# EAGLE design btnsm_water (EAGLE 8.3.0)
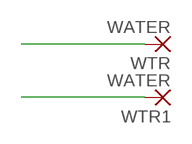
[diagram p0: schematic, sheet 1]

## Parts
WTR  WATER  1,6/0,9  [1,6/0,9]
WTR1  WATER  1,6/0,9  [1,6/0,9]

## Nets
W1: WTR.1(P)
W2: WTR1.1(P)

## Library data of the parts
WTR WTR1 = wirepad:1,6/0,9: THROUGH-HOLE PAD

## Net classes
0 default: width 0.3 mm, drill 0.3 mm, clearance 0.178 mm

## Board
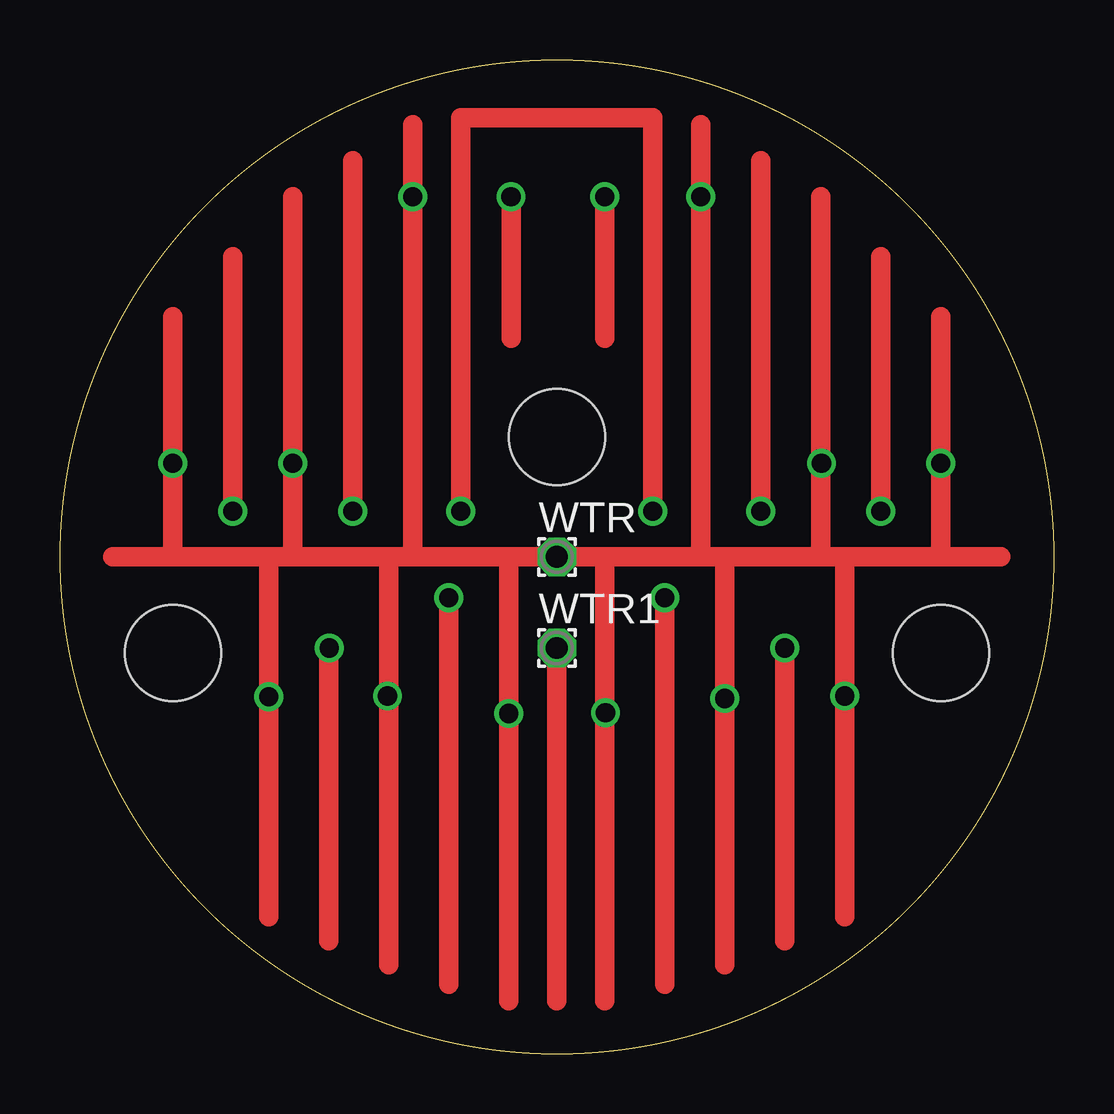
[diagram p1: board, top side]
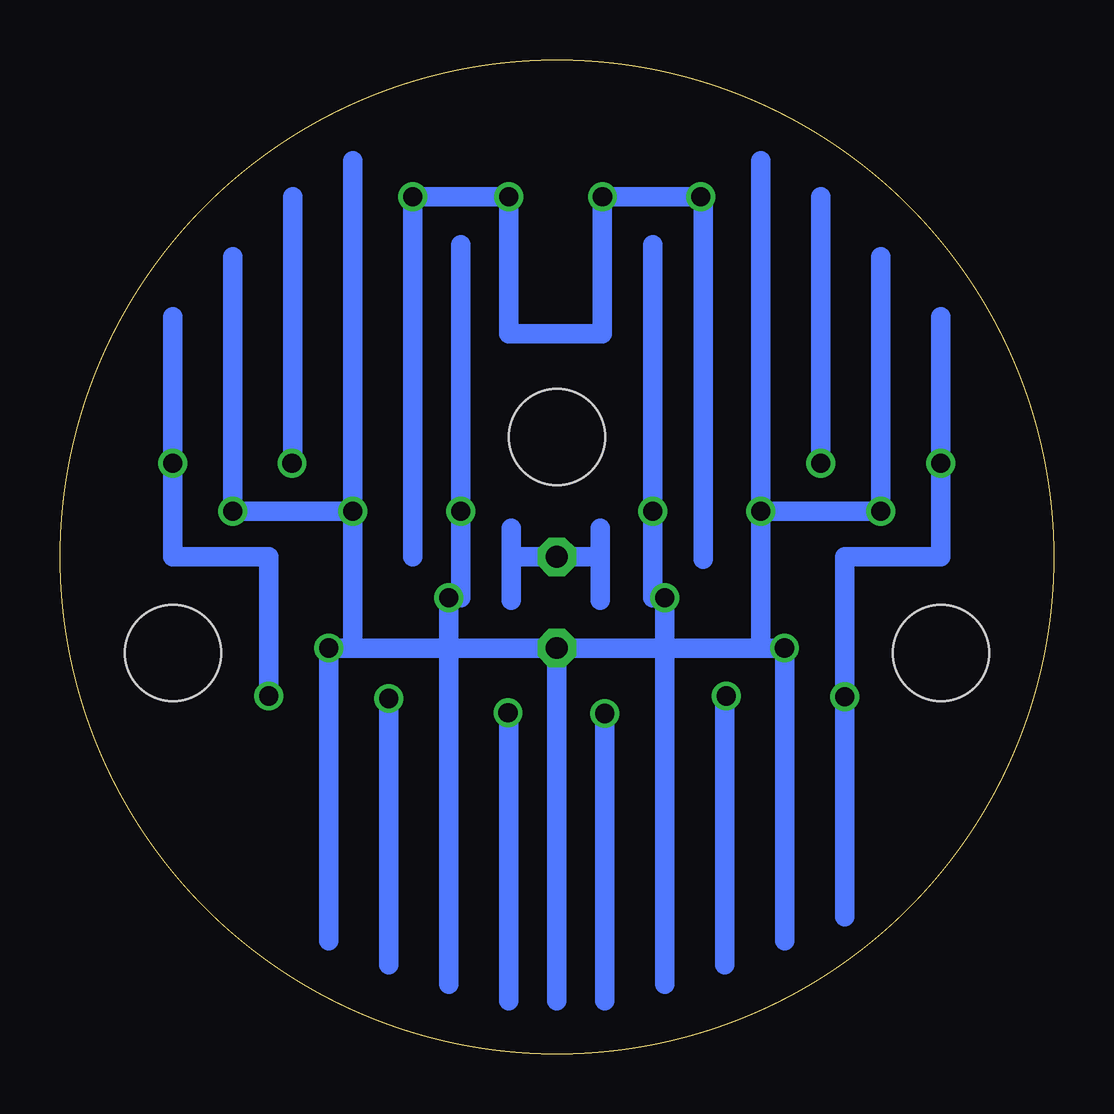
[diagram p2: board, bottom side, seen from below]

Size 41.4 x 41.4 mm. Coordinates in mm from the lower left corner, seen from the top.
Outline: circle at 20.7,20.7 radius 20.7
Copper layers (1*16): Top 0.035mm / dielectric 1.5mm / Bottom 0.035mm
Design rules "SeeedStudio_2layer_DRU_no_angle_20140221": minimum track width 6mil, minimum drill 12mil, track to track 6mil, track to pad 6mil, pad to pad 6mil, via to via 6mil, smd to smd 0mil, copper to edge 10mil, drill to drill 10mil, minimum pad ring 10mil, minimum via ring 6mil, stop-mask expansion 2mil, vias tented up to drill 100mil, thermal gap 10mil
Holes 4 mm at 20.7,25.7 4.7,16.7 36.7,16.7

### Footprints (pad centres in the part's own frame; a part is rotated, then mirrored left to right if it is on the bottom)
1,6/0,9 = drill 0.914 pad 1.6 octagon: 1 0,0

### Placement (x,y rotation side)
WTR  20.7,20.7 0 top
WTR1  20.7,16.9 0 top

### Tracks (layer width: path | path; a pad name or v marks a point on that pad's centre or on a via)
W1  (via drill 0.8)
  Top 0.813: 36.7,20.7 39.2,20.7 | 36.7,20.7 v36.7,24.6 36.7,30.7 | 31.7,24.6 31.7,20.7 | 31.7,24.6 31.7,35.7 | 26.7,20.7 v26.7,35.7 26.7,38.7 | 9.7,20.7 v9.7,24.6 9.7,35.7 | 4.7,20.7 v4.7,24.6 4.7,30.7 | 8.7,20.7 v8.7,14.87 8.7,5.7 | 13.7,14.8 13.7,20.7 | 13.7,14.8 13.7,3.7 | 18.7,2.2 v18.7,14.17 18.7,20.7 | 22.7,14.1 22.7,20.7 | 22.7,14.1 22.7,2.2 | 27.7,20.7 v27.7,14.8 27.7,3.7 | 32.7,20.7 v32.7,14.9 32.7,5.7 | 14.7,20.7 v14.7,35.7 14.7,38.7 | v18.79,35.7 v18.8,35.7 18.8,29.8 | v22.7,35.7 22.7,29.8 | 13.7,14.8 13.64,14.8 v13.64,14.9 | 22.7,14.1 22.73,14.1 v22.73,14.2 | 31.7,24.6 v31.73,24.6 | 4.7,20.7 2.2,20.7 | 4.7,20.7 8.7,20.7 | 8.7,20.7 9.7,20.7 | 13.7,20.7 9.7,20.7 | 18.7,20.7 14.7,20.7 | 18.7,20.7 WTR.1 22.7,20.7 | 13.7,20.7 14.7,20.7 | 22.7,20.7 27.7,20.7 | 31.7,20.7 27.7,20.7 | 31.7,20.7 36.7,20.7
  Bottom 0.813: 14.6,20.6 14.6,35.7 v14.7,35.7 v18.79,35.7 v18.8,35.7 18.8,30 22.7,30 v22.7,35.7 v26.7,35.7 26.7,20.7 | v32.7,14.9 32.7,20.7 36.7,20.7 v36.7,24.6 36.7,30.7 | 22.6,20.7 WTR.1 18.9,20.7 | 22.6,20.7 22.6,21.9 | 18.9,20.7 18.9,21.9 | 18.9,20.7 18.9,18.9 | 22.6,20.7 22.6,18.9 | 8.7,5.7 v8.7,14.87 8.7,20.7 4.7,20.7 v4.7,24.6 4.7,30.7 | v13.64,14.9 13.7,14.9 13.7,3.7 | v18.7,14.17 18.7,2.2 | v22.73,14.2 22.7,14.2 22.7,2.2 | v27.7,14.8 27.7,3.7 | v9.7,24.6 9.7,35.7 | v31.73,24.6 31.7,24.6 31.7,35.7
W2  (via drill 0.8)
  Top 0.813: WTR1.1 20.7,2.2 | v30.2,16.9 30.2,4.7 | v11.22,16.9 11.2,16.9 11.2,4.7 | v25.2,19 25.2,2.9 | v12.2,22.6 12.2,37.2 | v29.2,22.6 29.2,37.2 | v7.2,22.6 7.2,33.2 | v34.2,22.6 34.2,33.2 | v16.7,22.6 16.7,39 24.7,39 v24.7,22.6 | 16.2,2.9 v16.2,19
  Bottom 0.813: 15.6,16.9 16.3,16.9 | 15.6,16.9 v11.22,16.9 | v11.22,16.9 11.2,16.9 | v11.22,16.9 15.6,16.9 | 15.6,16.9 16.3,16.9 | 16.3,16.9 WTR1.1 | 25.1,16.9 v30.2,16.9 | 11.2,16.9 v11.22,16.9 | 16.3,16.9 16.2,16.9 v16.2,19 | 25.1,16.9 25.2,16.9 v25.2,19 | 16.3,16.9 WTR1.1 | 25.1,16.9 WTR1.1 | v12.2,22.6 12.2,16.9 15.6,16.9 | v30.2,16.9 29.2,16.9 v29.2,22.6 | v12.2,22.6 v7.2,22.6 7.2,33.2 | v29.2,22.6 v34.2,22.6 34.2,33.2 | v16.2,19 16.7,19 v16.7,22.6 16.7,33.7 | v25.2,19 24.7,19 v24.7,22.6 24.7,33.7 | v12.2,22.6 12.2,37.2 | v29.2,22.6 29.2,37.2 | v11.22,16.9 11.2,16.9 | 11.2,16.9 11.2,4.7 | v30.2,16.9 30.2,4.7 | WTR1.1 20.7,2.2 | v16.2,19 16.2,2.9 | v25.2,19 25.2,2.9